# EAGLE design 519_sch (EAGLE 7.6.0)
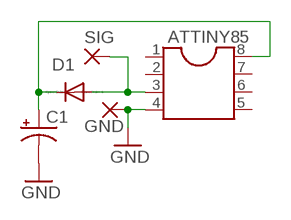
[diagram p0: schematic, sheet 1]

## Parts
ATTINY85  DIL8  [DIL08]
C1  CPOL-USE2,5-6E  [E2,5-6E]
D1  1N4148DO35-7  [DO35-7]
GND  3,81/1,4  [3,81/1,4]
SIG  3,81/1,4  [3,81/1,4]

## Nets
GND: ATTINY85.4 C1.- GND.1(P)
N$1: ATTINY85.8 C1.+ D1.C
N$2: ATTINY85.3 D1.A SIG.1(P)
Unconnected: ATTINY85.1 ATTINY85.2 ATTINY85.5 ATTINY85.6 ATTINY85.7

## Library data of the parts
ATTINY85 = ic-package:DIL8: Dual In Line / Socket
C1 = rcl:CPOL-US: POLARIZED CAPACITOR, American symbol
D1 = diode:1N4148: DIODE high speed (Philips)
GND SIG = wirepad:3,81/1,4: THROUGH-HOLE PAD

## Board
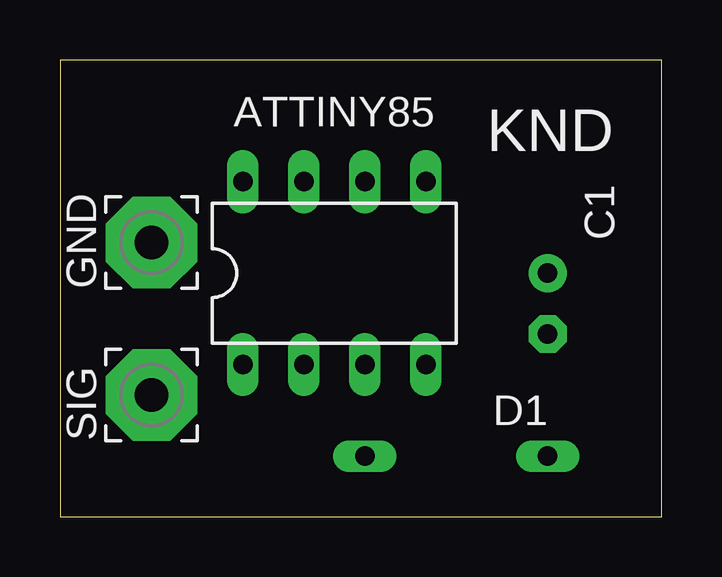
[diagram p1: board, top side]
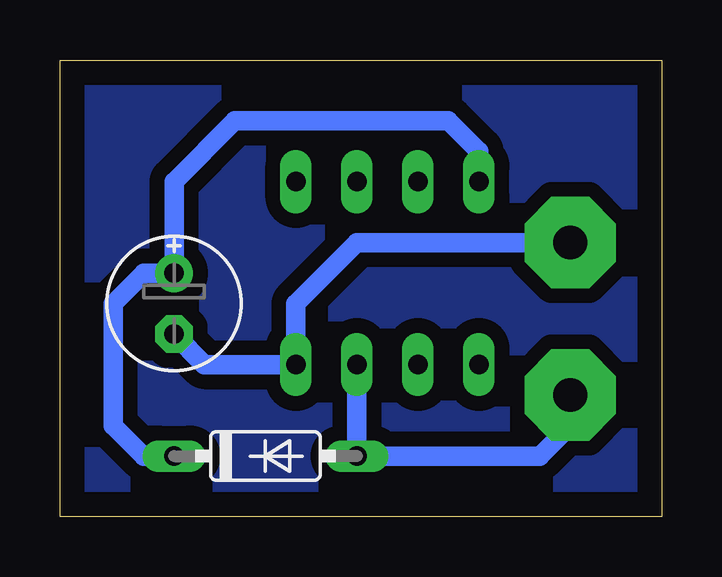
[diagram p2: board, bottom side, seen from below]

Size 25.07 x 19.04 mm. Coordinates in mm from the lower left corner, seen from the top.
Outline: 0,0 25.07,0 25.07,19.04 0,19.04 0,0
Copper layers (1*16): Top 0.035mm / dielectric 1.5mm / Bottom 0.035mm
Design rules "default": minimum track width 10mil, minimum drill 24mil, track to track 8mil, track to pad 8mil, pad to pad 8mil, via to via 8mil, smd to smd 8mil, copper to edge 40mil, drill to drill 8mil, minimum pad ring 10mil, minimum via ring 8mil, stop-mask expansion 4mil, vias tented up to drill 0mil, thermal gap 10mil

### Footprints (pad centres in the part's own frame; a part is rotated, then mirrored left to right if it is on the bottom)
DIL08 = drill 0.813 long: 1 -3.81,-3.81; 2 -1.27,-3.81; 3 1.27,-3.81; 4 3.81,-3.81; 5 3.81,3.81; 6 1.27,3.81; 7 -1.27,3.81; 8 -3.81,3.81
E2,5-6E = drill 0.813 pad 1.575: + -1.27,0 | drill 0.813 pad 1.575 octagon: - 1.27,0
DO35-7 = drill 0.813 long: A 3.81,0; C -3.81,0
3,81/1,4 = drill 1.397 pad 3.81 octagon: 1 0,0

### Placement (x,y rotation side)
ATTINY85  11.43,10.16 0 top
C1  20.32,8.89 270 bottom
D1  16.51,2.54 0 bottom
GND  3.81,11.43 90 top
SIG  3.81,5.08 90 top

### Tracks (layer width: path | path; a pad name or v marks a point on that pad's centre or on a via)
GND
  Bottom 0.813: GND.1 12.7,11.43 15.24,8.89 ATTINY85.4 19.05,6.35 C1.-
N$1
  Bottom 0.813: ATTINY85.8 7.62,15.24 8.89,16.51 17.78,16.51 20.32,13.97 C1.+ 21.59,10.16 22.86,8.89 22.86,3.81 21.59,2.54 D1.C
N$2
  Bottom 0.813: ATTINY85.3 D1.A 5.08,2.54 3.81,3.81 SIG.1
N$3
  pour Bottom (isolate 0.61): 0,17.78 24.13,17.78 24.13,0 0,0

### Text on the board
tNames: KND